# Altium schematic sheet 12v_wall.SchDoc
size A4
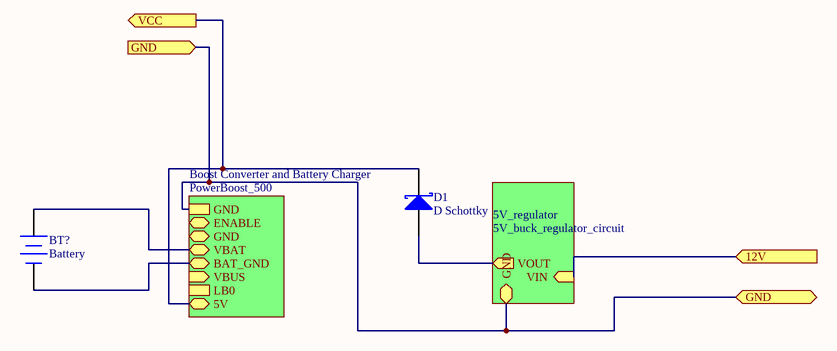
[diagram p0: 12v_wall.SchDoc]

## Parts
BT?  Battery  [BAT-2]
D1  D Schottky  [SMB]

## Sub-sheets
5V_regulator = 5V_buck_regulator_circuit: VOUT (out), GND (bidir), VIN (in)
Boost Converter and Battery Charger = PowerBoost_500: GND, ENABLE (bidir), GND (bidir), VBAT (bidir), BAT_GND (bidir), VBUS (in), LB0, 5V (bidir)

## Ports
12V (in), GND (bidir), GND (in), VCC (out)

## Nets
12V: port 12V, sheet 5V_regulator/VIN
GND: port GND, sheet Boost Converter and Battery Charger/GND, sheet 5V_regulator/GND
VCC: D1.2(K) ; port VCC, sheet Boost Converter and Battery Charger/5V
NetBT?_1: BT?.1(+) ; sheet Boost Converter and Battery Charger/VBAT
NetBT?_2: BT?.2(-) ; sheet Boost Converter and Battery Charger/BAT_GND
NetD1_1: D1.1(A) ; sheet 5V_regulator/VOUT

## Library data of the parts
BT? = Battery: Multicell Battery; Published: 24-Mar-1999; LatestRevisionDate: 17-Jul-2002; LatestRevisionNote: Re-released for DXP Platform.; PackageReference: BAT-2; Publisher: Altium Limited; PackageDescription: Battery; 2 Leads
D1 = D Schottky: Schottky Diode; Published: 8-Jun-2000; LatestRevisionDate: 17-Jul-2002; LatestRevisionNote: Re-released for DXP Platform.; PackageReference: SMB; Publisher: Altium Limited; PackageDescription: DO-214-AA/SMB; 2 C-Bend Leads; Body 5.3 x 3.6 mm, inc. leads (LxW); Code_JEDEC: DO-214-AA